# Altium schematic sheet Connector.SchDoc
size A4; SheetNumber: 6; SheetTotal: 6; ProjectTitle: PD_SMARTKEY_EMN-EVAN_V2
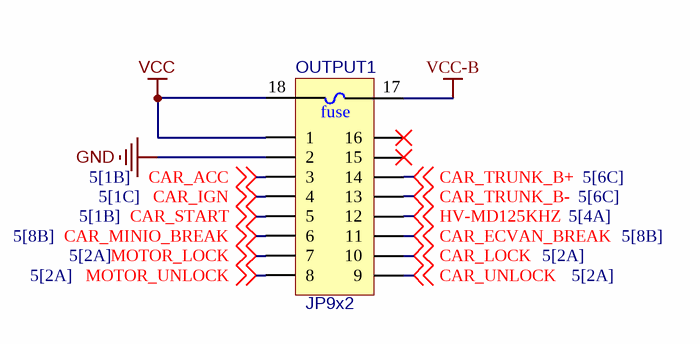
[diagram p0: Connector.SchDoc]

## Parts
OUTPUT1  JP9x2  [9x2_JP200]

## Nets
GND: OUTPUT1.2
VCC: OUTPUT1.1 OUTPUT1.18
VCC-B: OUTPUT1.17
CAR_ACC: OUTPUT1.3 ; off-sheet CAR_ACC
CAR_ECVAN_BREAK: OUTPUT1.11 ; off-sheet CAR_ECVAN_BREAK
CAR_IGN: OUTPUT1.4 ; off-sheet CAR_IGN
CAR_LOCK: OUTPUT1.10 ; off-sheet CAR_LOCK
CAR_MINIO_BREAK: OUTPUT1.6 ; off-sheet CAR_MINIO_BREAK
CAR_START: OUTPUT1.5 ; off-sheet CAR_START
CAR_TRUNK_B+: OUTPUT1.14 ; off-sheet CAR_TRUNK_B+
CAR_TRUNK_B-: OUTPUT1.13 ; off-sheet CAR_TRUNK_B-
CAR_UNLOCK: OUTPUT1.9 ; off-sheet CAR_UNLOCK
HV-MD125KHZ: OUTPUT1.12 ; off-sheet HV-MD125KHZ
MOTOR_LOCK: OUTPUT1.7 ; off-sheet MOTOR_LOCK
MOTOR_UNLOCK: OUTPUT1.8 ; off-sheet MOTOR_UNLOCK

Not connected (* = marked no-connect by the designer): OUTPUT1 15* 16*

## Notes on the sheet
- Author:
- Title:
- Size:
- A4
- Project:
- Approved:
- Revision:
- Modified Date:
- CONFIDENTIAL
- Date:
- SW Version:
- (in symbol JP9x2_1) fuse

## Library data of the parts
OUTPUT1 = JP9x2_1: WR-PHD 2.54 mm Dual Socket Header; Manufacturer: W¨¹rth Elektronik eiSos GmbH; partNo: 61301821821; ComponentLink1 Description: Manufacturer; ComponentLink2 Description: Datasheet; NoPins: 18; Created Date: 29 March 2013; ComponentLink1URL: http://www.we-online.com; ComponentLink2URL: http://katalog.we-online.de/em/datasheet/6130xx21821.pdf; Created by: Karrer Zheng